# Altium project Rozgi.PrjPcb
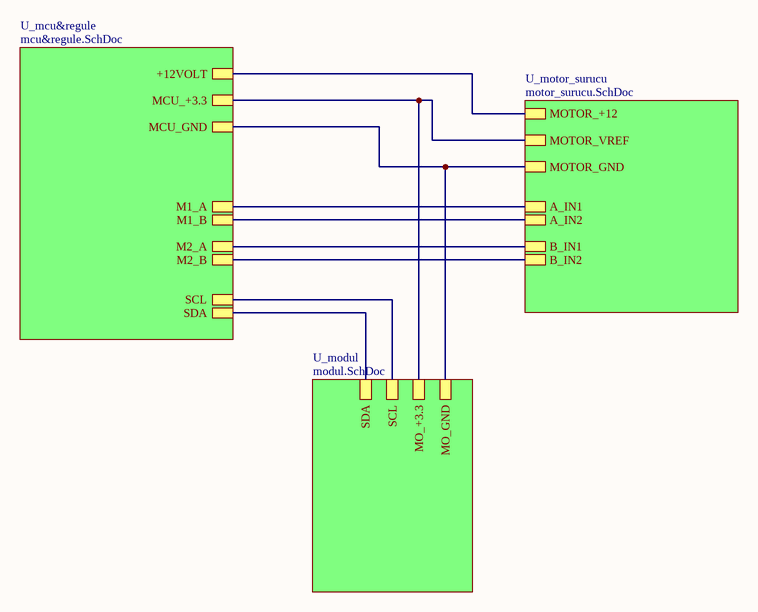
[diagram p0: main.SchDoc]
4 sheets, 87 parts. Net scope: hierarchical (ports join the sheet entries above them; power ports are global).
Board file: basit.PcbDoc
Sheets:
  main.SchDoc
    U_mcu&regule = mcu&regule.SchDoc
    U_modul = modul.SchDoc
    U_motor_surucu = motor_surucu.SchDoc

## Sheet main.SchDoc
size 250 x 180 mm

### Sub-sheets
U_mcu&regule = mcu&regule.SchDoc: +12VOLT, M1_A, M1_B, M2_A, M2_B, MCU_GND, MCU_+3.3, SCL, SDA
U_modul = modul.SchDoc: MO_GND, MO_+3.3, SCL, SDA
U_motor_surucu = motor_surucu.SchDoc: MOTOR_GND, MOTOR_+12, MOTOR_VREF, A_IN1, A_IN2, B_IN1, B_IN2

### Nets
+3.3: sheet U_mcu&regule/MCU_+3.3, sheet U_modul/MO_+3.3, sheet U_motor_surucu/MOTOR_VREF
+12: sheet U_mcu&regule/+12VOLT, sheet U_motor_surucu/MOTOR_+12
GND: sheet U_mcu&regule/MCU_GND, sheet U_modul/MO_GND, sheet U_motor_surucu/MOTOR_GND
SCL: sheet U_mcu&regule/SCL, sheet U_modul/SCL
SDA: sheet U_mcu&regule/SDA, sheet U_modul/SDA
NetR19_1: sheet U_mcu&regule/M1_B, sheet U_motor_surucu/A_IN2
NetR20_1: sheet U_mcu&regule/M2_B, sheet U_motor_surucu/B_IN2
NetR21_1: sheet U_mcu&regule/M1_A, sheet U_motor_surucu/A_IN1
NetR22_1: sheet U_mcu&regule/M2_A, sheet U_motor_surucu/B_IN1

## Sheet mcu&regule.SchDoc
size A4
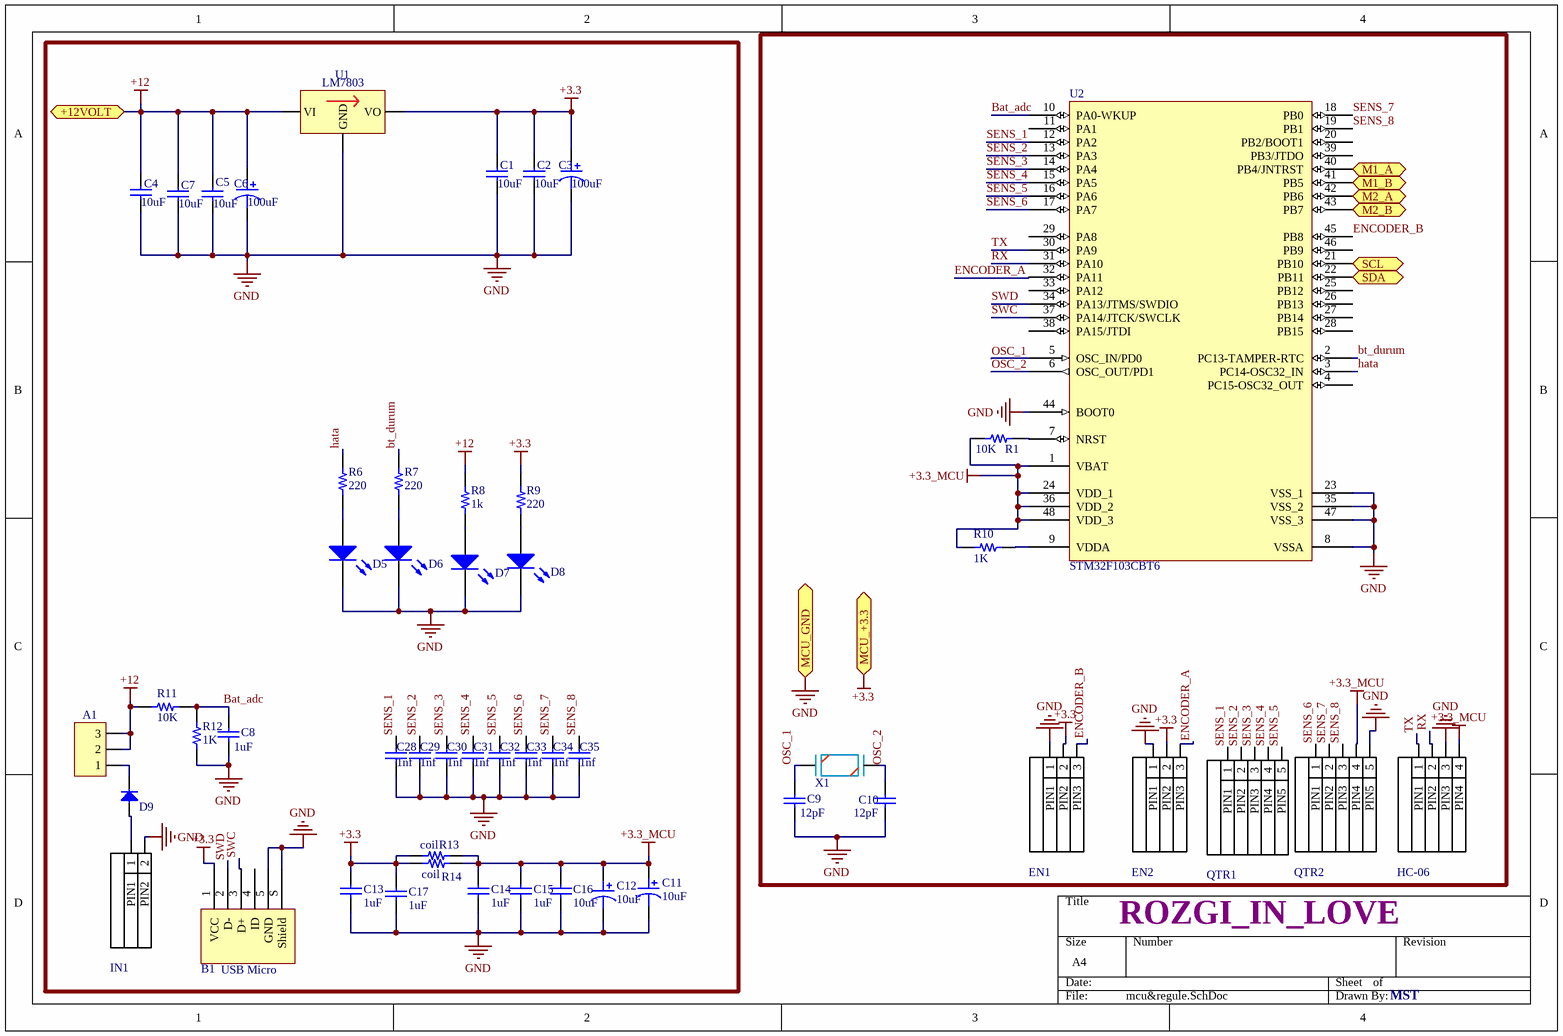
[diagram p1: mcu&regule.SchDoc]

### Parts
A1  anahtar  [MSS22D18 Switch]  (value not drawn)
B1  USB Micro  [FCI USB 10118193-0001LF]
C1  10uF  [Cap SMD C1206]
C2  10uF  [Cap SMD C1206]
C3  100uF  [Cap SMD ALU 6.3X6.3N]
C4  10uF  [Cap SMD C1206]
C5  10uF  [Cap SMD C1206]
C6  100uF  [Cap SMD ALU 6.3X6.3N]
C7  10uF  [Cap SMD C1206]
C8  1uF  [CAP SMD C0603]
C9  12pF  [CAP SMD C0603]
C10  12pF  [CAP SMD C0603]
C11  10uF  [Cap Tantal 3216 - Type A]
C12  10uF  [Cap Tantal 3216 - Type A]
C13  1uF  [CAP SMD C0603]
C14  1uF  [CAP SMD C0603]
C15  1uF  [CAP SMD C0603]
C16  10uF  [CAP SMD C0603]
C17  1uF  [CAP SMD C0603]
C28  1nf  [CAP SMD C0603]
C29  1nf  [CAP SMD C0603]
C30  1nf  [CAP SMD C0603]
C31  1nf  [CAP SMD C0603]
C32  1nf  [CAP SMD C0603]
C33  1nf  [CAP SMD C0603]
C34  1nf  [CAP SMD C0603]
C35  1nf  [CAP SMD C0603]
D5  (no value)  [LED 0603/1608 GREEN]
D6  (no value)  [LED 0603/1608 GREEN]
D7  (no value)  [LED 0603/1608 BLUE]
D8  (no value)  [LED 0603/1608 GREEN]
D9  Äèîä âûïğÿìèòåëüíûé  1N4148 (150mA 75V)  DO-35  [SMB, DO-214AA]  (value not drawn)
EN1  Ğàçú¸ì PLS-3  [JST B3B-PH-K]  (value not drawn)
EN2  Ğàçú¸ì PLS-3  [JST B3B-PH-K]  (value not drawn)
HC-06  Ğàçú¸ì PLS-4  [JST B4B-PH-K]  (value not drawn)
IN1  Ğàçú¸ì PLS-2  [HDR1X2]  (value not drawn)
QTR1  Ğàçú¸ì PLS-5  [JST B5B-PH-K]  (value not drawn)
QTR2  Ğàçú¸ì PLS-5  [JST B5B-PH-K]  (value not drawn)
R1  10K  [RES 0603]
R6  220  [RES 0603]
R7  220  [RES 0603]
R8  1k  [RES 0603]
R9  220  [RES 0603]
R10  1K  [RES 0603]
R11  10K  [RES 0603]
R12  1K  [RES 0603]
R13  coil  [RES 0805]
R14  coil  [RES 0805]
U1  LM7803  [DPAK, TO-252-3L]
U2  STM32F103CBT6  [TQFP-48_N]
X1  8MHZ XTAL  [ABM7  6.2 x 3.5 mm]  (value not drawn)

### Ports
+12VOLT, M1_A, M1_B, M2_A, M2_B, MCU_+3.3, MCU_GND, SCL, SDA

### Nets
+3.3: B1.1(VCC) C1.2 C2.2 C3.1 C13.2 C17.2 EN1.2(PIN2) EN2.2(PIN2) R9.2 R13.1 R14.1 U1.3(VO) ; port MCU_+3.3
+3.3_MCU: C11.1 C12.1 C14.2 C15.2 C16.2 HC-06.4(PIN4) QTR2.4(PIN4) R1.1 R10.1 R13.2 R14.2 U2.1(VBAT) U2.24(VDD_1) U2.36(VDD_2) U2.48(VDD_3)
+12: A1.2 A1.3 C4.2 C5.2 C6.1 C7.2 R8.2 R11.1 U1.1(VI) ; port +12VOLT
GND: B1.5(GND) B1.S(Shield) C1.1 C2.1 C3.2 C4.1 C5.1 C6.2 C7.1 C8.1 C9.1 C10.1 C11.2 C12.2 C13.1 C14.1 C15.1 C16.1 C17.1 C28.1 C29.1 C30.1 C31.1 C32.1 C33.1 C34.1 C35.1 D5.1(C) D6.1(C) D7.1(C) D8.1(C) EN1.1(PIN1) EN2.1(PIN1) HC-06.3(PIN3) IN1.2(PIN2) QTR2.5(PIN5) R12.1 U1.2(GND) U2.8(VSSA) U2.23(VSS_1) U2.35(VSS_2) U2.44(BOOT0) U2.47(VSS_3) ; port MCU_GND
Bat_adc: C8.2 R11.2 R12.2 U2.10(PA0-WKUP)
bt_durum: R7.2 U2.2(PC13-TAMPER-RTC)
ENCODER_A: EN2.3(PIN3) U2.32(PA11)
ENCODER_B: EN1.3(PIN3) U2.45(PB8)
hata: R6.2 U2.3(PC14-OSC32_IN)
OSC_1: C9.2 U2.5(OSC_IN/PD0) X1.1
OSC_2: C10.2 U2.6(OSC_OUT/PD1) X1.2
RX: HC-06.2(PIN2) U2.31(PA10)
SCL: U2.21(PB10) ; port SCL
SDA: U2.22(PB11) ; port SDA
SENS_1: C28.2 QTR1.1(PIN1) U2.12(PA2)
SENS_2: C29.2 QTR1.2(PIN2) U2.13(PA3)
SENS_3: C30.2 QTR1.3(PIN3) U2.14(PA4)
SENS_4: C31.2 QTR1.4(PIN4) U2.15(PA5)
SENS_5: C32.2 QTR1.5(PIN5) U2.16(PA6)
SENS_6: C33.2 QTR2.1(PIN1) U2.17(PA7)
SENS_7: C34.2 QTR2.2(PIN2) U2.18(PB0)
SENS_8: C35.2 QTR2.3(PIN3) U2.19(PB1)
SWC: B1.3(D+) U2.37(PA14/JTCK/SWCLK)
SWD: B1.2(D-) U2.34(PA13/JTMS/SWDIO)
TX: HC-06.1(PIN1) U2.30(PA9)
NetA1_1: A1.1 D9.1(C)
NetD5_2: D5.2(A) R6.1
NetD6_2: D6.2(A) R7.1
NetD7_2: D7.2(A) R8.1
NetD8_2: D8.2(A) R9.1
NetD9_2: D9.2(A) IN1.1(PIN1)
NetR1_2: R1.2 U2.7(NRST)
NetR10_2: R10.2 U2.9(VDDA)
NetR19_1: U2.41(PB5) ; port M1_B
NetR20_1: U2.43(PB7) ; port M2_B
NetR21_1: U2.40(PB4/JNTRST) ; port M1_A
NetR22_1: U2.42(PB6) ; port M2_A

Not connected (* = marked no-connect by the designer): B1 4(ID); U2 4(PC15-OSC32_OUT) 11(PA1) 20(PB2/BOOT1) 25(PB12) 26(PB13) 27(PB14) 28(PB15) 29(PA8) 33(PA12) 38(PA15/JTDI) 39(PB3/JTDO) 46(PB9)

### Notes on the sheet
- ROZGI_IN_LOVE
- MST

### Library data of the parts
A1 = anahtarlar
B1 = USB 2.0 Type B Micro
C1 C2 C4 C5 C7 = CAP SMD THT: CAP SMD; Value: 10uF
C3 C6 = CAP-SMD -ALU: CAP-ALU; Value: 100uF
C8 C28-C35 = CAP SMD THT: CAP SMD; Value: 10nF
C9 C10 C13-C17 = CAP SMD THT: CAP SMD; Value: 100nF
C11 C12 = CAP-SMD -TANTAL: CAP-TANTAL; Value: 10uF
D5-D8 = LED: Typical LED; Voltage: 3V; Current: 20mA; ComponentLink2Description: Datasheet
D9 = Diode: ComponentLink2Description: Datasheet; ComponentLink1Description: Ñàéò ïğîèçâîäèòåëÿ; Family: Äèîä âûïğÿìèòåëüíûé; Package: DO-35; Voltage: 75V; Current: 150mA; ComponentLink3Description: Ãäå êóïèòü?; Device: 1N4148
EN1 EN2 = HDR 1x3: Male, 3 pin single in line, 2.54; ComponentLink1Description: Ñàéò ïğîèçâîäèòåëÿ; ComponentLink2Description: Datasheet; Device: PLS-3; Family: Ğàçú¸ì; ComponentLink3Description: Ãäå êóïèòü?
HC-06 = HDR 1x4: Male, 4 pin single in line, 2.54; ComponentLink1Description: Ñàéò ïğîèçâîäèòåëÿ; ComponentLink2Description: Datasheet; Device: PLS-4; Family: Ğàçú¸ì; ComponentLink3Description: Ãäå êóïèòü?
IN1 = HDR 1x2: Male, 2 pin single in line, 2.54; ComponentLink1Description: Ñàéò ïğîèçâîäèòåëÿ; ComponentLink2Description: Datasheet; Device: PLS-2; Family: Ğàçú¸ì; ComponentLink3Description: Ãäå êóïèòü?
QTR1 QTR2 = HDR 1x5: Male, 5 pin single in line, 2.54; ComponentLink1Description: Ñàéò ïğîèçâîäèòåëÿ; ComponentLink2Description: Datasheet; Device: PLS-5; Family: Ğàçú¸ì; ComponentLink3Description: Ãäå êóïèòü?
R1 R6 R7 R9 R11 R13 R14 = RES: Value: 1K
R8 R10 R12 = RES: Value: 1K
U1 = lm7805
U2 = STM32F103CBT6: STM32 ARM-based 32-bit MCU with 128 Kbytes Flash, 48-pin LQFP, Industrial Temperature; Published: 30-May-2008; DatasheetVersion: rev6, Mar-2008; PackageVersion: Mar-2008; PackageReference: LQFP48; Publisher: Altium Limited; PackageDescription: 48-Pin Low-Profile Quad Flat Pack, 7 x 7 mm Body, 0.5 mm Pitch (LQFP48); ComponentLink1Description: Manufacturer Link; ComponentLink1URL: www.st.com/stm32; ComponentLink2Description: Datasheet; ComponentLink2URL: http://www.st.com/stonline/products/literature/ds/13587.pdf

## Sheet modul.SchDoc
size 180 x 160 mm
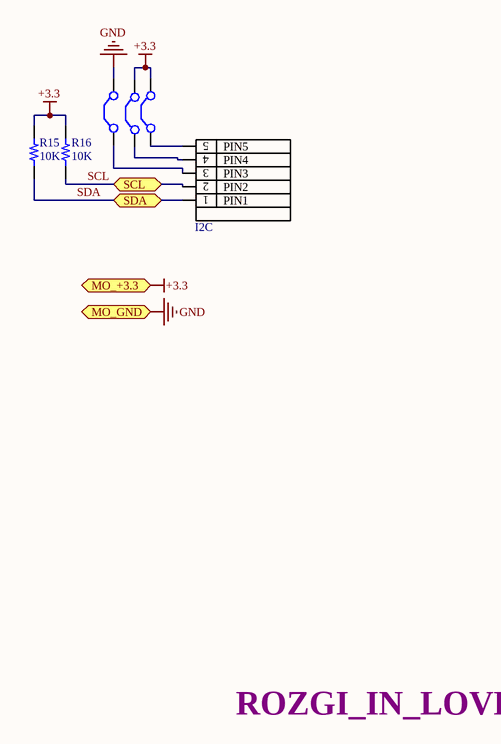
[diagram p2: modul.SchDoc]

### Parts
I2C  Ğàçú¸ì PLS-5  [JST B5B-PH-K]  (value not drawn)
JS1  Ïåğåìû÷êà SMD 1206  [Jumper SMD Small]  (value not drawn)  (net tie, no BOM)
JS2  Ïåğåìû÷êà SMD 1206  [Jumper SMD Small]  (value not drawn)  (net tie, no BOM)
JS3  Ïåğåìû÷êà SMD 1206  [Jumper SMD Small]  (value not drawn)  (net tie, no BOM)
R15  10K  [RES 0603]
R16  10K  [RES 0603]

### Ports
MO_+3.3, MO_GND, SCL, SDA

### Nets
+3.3: JS2.2 JS3.2 R15.2 R16.2 ; port MO_+3.3
GND: JS1.2 ; port MO_GND
SCL: I2C.1(PIN2) R16.1 ; port SCL
SDA: I2C.2(PIN1) R15.1 ; port SDA
NetI2C_3: I2C.3(PIN3) JS1.1
NetI2C_4: I2C.4(PIN4) JS3.1
NetI2C_5: I2C.5(PIN5) JS2.1

### Notes on the sheet
- ROZGI_IN_LOVE

### Library data of the parts
I2C = HDR 1x5: Male, 5 pin single in line, 2.54; ComponentLink1Description: Ñàéò ïğîèçâîäèòåëÿ; ComponentLink2Description: Datasheet; Device: PLS-5; Family: Ğàçú¸ì; ComponentLink3Description: Ãäå êóïèòü?
JS1-JS3 = Jumper: Ïåğåìû÷êà; Device: SMD 1206; Family: Ïåğåìû÷êà; Name: Jumper
R15 R16 = RES: Value: 1K

## Sheet motor_surucu.SchDoc
size 250 x 180 mm
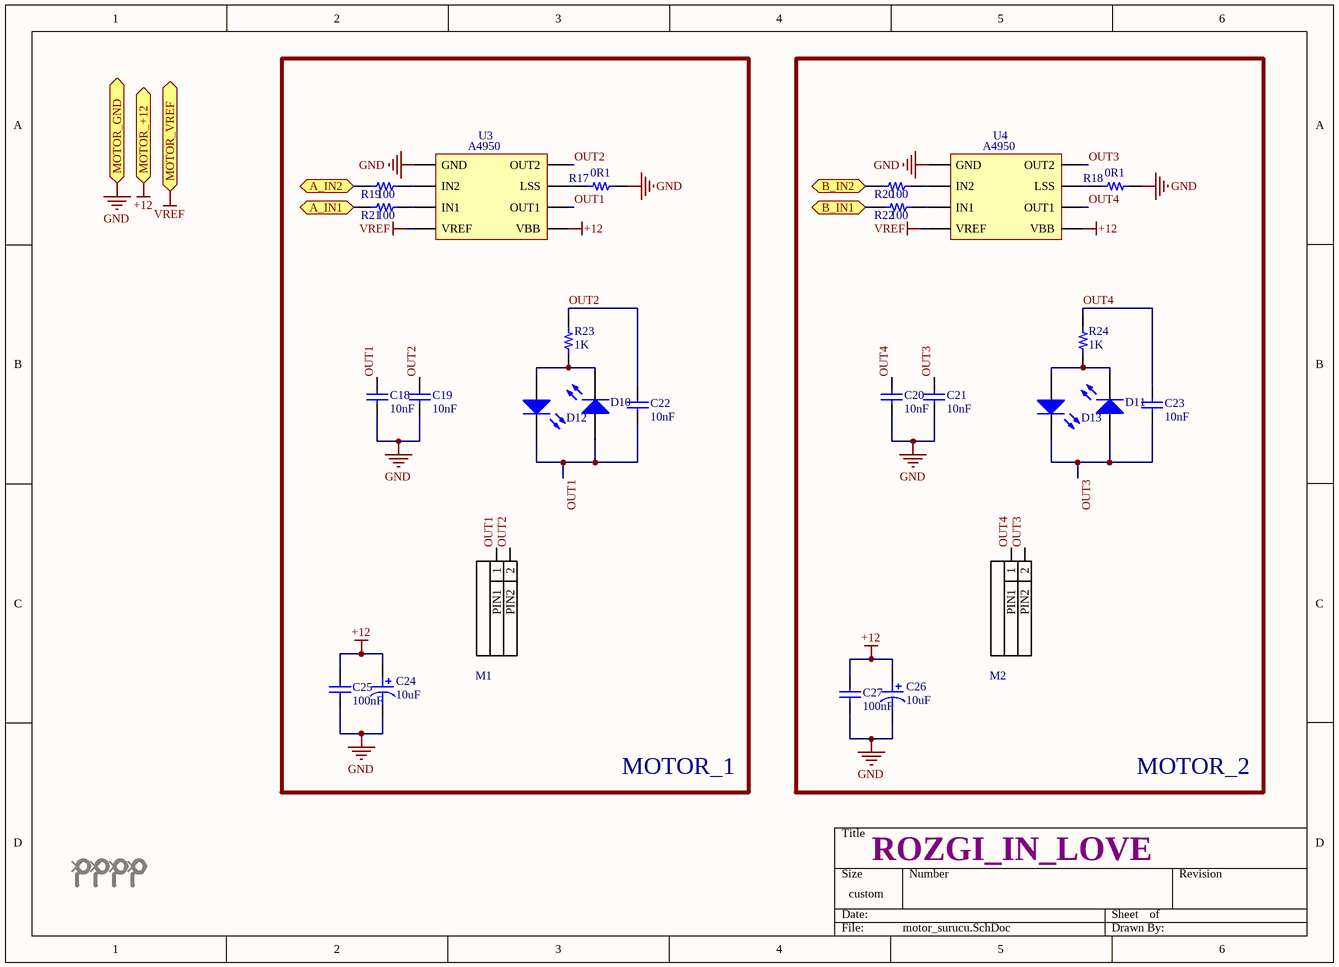
[diagram p3: motor_surucu.SchDoc]

### Parts
1  VİDA  [M2]  (value not drawn)
2  VİDA  [M2]  (value not drawn)
3  VİDA  [M2]  (value not drawn)
4  VİDA  [M2]  (value not drawn)
C18  10nF  [CAP SMD C0603]
C19  10nF  [CAP SMD C0603]
C20  10nF  [CAP SMD C0603]
C21  10nF  [CAP SMD C0603]
C22  10nF  [CAP SMD C0603]
C23  10nF  [CAP SMD C0603]
C24  10uF  [Cap Tantal 3528 - Type B]
C25  100nF  [CAP SMD C0603]
C26  10uF  [Cap Tantal 3528 - Type B]
C27  100nF  [CAP SMD C0603]
D10  (no value)  [LED 0603/1608 GREEN]
D11  (no value)  [LED 0603/1608 GREEN]
D12  (no value)  [LED 0603/1608 RED]
D13  (no value)  [LED 0603/1608 RED]
M1  Ğàçú¸ì PLS-2  [HDR1X2]  (value not drawn)
M2  Ğàçú¸ì PLS-2  [HDR1X2]  (value not drawn)
R17  0R1  [STACKPOLE CSRN2512]
R18  0R1  [STACKPOLE CSRN2512]
R19  100  [RES 0603]
R20  100  [RES 0603]
R21  100  [RES 0603]
R22  100  [RES 0603]
R23  1K  [RES 0603]
R24  1K  [RES 0603]
U3  A4950  [SOIC8-EP_motor]
U4  A4950  [SOIC8-EP_motor]

### Blocks framed on the sheet
MOTOR_1: C18 C19 C22 C24 C25 D10 D12 M1 R17 R19 R21 R23 U3
MOTOR_2: C20 C21 C23 C26 C27 D11 D13 M2 R18 R20 R22 R24 U4

### Ports
A_IN1, A_IN2, B_IN1, B_IN2, MOTOR_+12, MOTOR_GND, MOTOR_VREF

### Nets
+12: C24.1 C25.2 C26.1 C27.2 U3.5(VBB) U4.5(VBB) ; port MOTOR_+12
GND: C18.1 C19.1 C20.1 C21.1 C24.2 C25.1 C26.2 C27.1 R17.2 R18.2 U3.1(GND) U4.1(GND) ; port MOTOR_GND
VREF: U3.4(VREF) U4.4(VREF) ; port MOTOR_VREF  [project net +3.3]
OUT1: C18.2 C22.1 D10.2(A) D12.1(C) M1.1(PIN1) U3.6(OUT1)
OUT2: C19.2 C22.2 M1.2(PIN2) R23.2 U3.8(OUT2)
OUT3: C21.2 C23.1 D11.2(A) D13.1(C) M2.2(PIN2) U4.8(OUT2)
OUT4: C20.2 C23.2 M2.1(PIN1) R24.2 U4.6(OUT1)
NetD10_1: D10.1(C) D12.2(A) R23.1
NetD11_1: D11.1(C) D13.2(A) R24.1
NetR17_1: R17.1 U3.7(LSS)
NetR18_1: R18.1 U4.7(LSS)
NetR19_1: R19.1 ; port A_IN2
NetR19_2: R19.2 U3.2(IN2)
NetR20_1: R20.1 ; port B_IN2
NetR20_2: R20.2 U4.2(IN2)
NetR21_1: R21.1 ; port A_IN1
NetR21_2: R21.2 U3.3(IN1)
NetR22_1: R22.1 ; port B_IN1
NetR22_2: R22.2 U4.3(IN1)

### Notes on the sheet
- ROZGI_IN_LOVE

### Library data of the parts
C18-C23 C25 C27 = CAP SMD THT: CAP SMD
  C18-C23: Value: 10nF
  C25 C27: Value: 100nF
C24 C26 = CAP-SMD -TANTAL: CAP-TANTAL; Value: 10uF
D10-D13 = LED: Typical LED; Voltage: 3V; Current: 20mA; ComponentLink2Description: Datasheet
M1 M2 = HDR 1x2: Male, 2 pin single in line, 2.54; ComponentLink1Description: Ñàéò ïğîèçâîäèòåëÿ; ComponentLink2Description: Datasheet; Device: PLS-2; Family: Ğàçú¸ì; ComponentLink3Description: Ãäå êóïèòü?
R17-R22 = RES: Value: 1K
R23 R24 = RES: Value: 1K

## Nets that join several sheets
+3.3: mcu&regule (12 pins), modul (JS2.2 JS3.2 R15.2 R16.2), motor_surucu (U3.4 U4.4)
+12: mcu&regule (9 pins), motor_surucu (6 pins)
GND: mcu&regule (43 pins), modul (JS1.2), motor_surucu (12 pins)
NetR19_1: mcu&regule (U2.41), motor_surucu (R19.1)
NetR20_1: mcu&regule (U2.43), motor_surucu (R20.1)
NetR21_1: mcu&regule (U2.40), motor_surucu (R21.1)
NetR22_1: mcu&regule (U2.42), motor_surucu (R22.1)
SCL: mcu&regule (U2.21), modul (I2C.1 R16.1)
SDA: mcu&regule (U2.22), modul (I2C.2 R15.1)